# Altium schematic sheet VDMEDA_Display1.SchDoc
size A
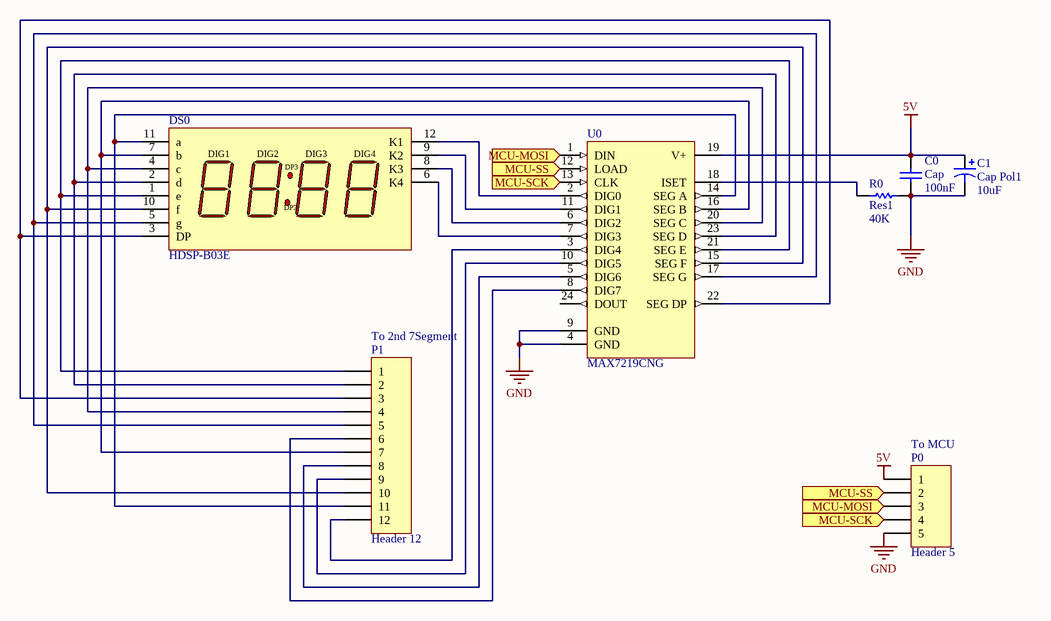
[diagram p0: VDMEDA_Display1.SchDoc]

## Parts
C0  Cap  value 100nF  [RAD-0.3]
C1  Cap Pol1  value 10uF  [RB7.6-15]
DS0  HDSP-B03E  [B-88]
P0  Header 5  [HDR1X5]
P1  Header 12  [HDR1X12]
R0  Res1  value 40K  [AXIAL-0.3]
U0  MAX7219CNG  [NG24A]

## Ports
MCU-MOSI (out), MCU-SCK (out), MCU-SS (out)

## Nets
5V: C0.2 C1.1 P0.1 U0.19(V+)
GND: C0.1 C1.2 P0.5 R0.2 U0.4(GND) U0.9(GND)
MCU-MOSI: P0.3 U0.1(DIN) ; port MCU-MOSI
MCU-SCK: P0.4 U0.13(CLK) ; port MCU-SCK
MCU-SS: P0.2 U0.12(LOAD) ; port MCU-SS
NetDS0_1: DS0.1(e) P1.1 U0.21(SEG_E)
NetDS0_2: DS0.2(d) P1.2 U0.23(SEG_D)
NetDS0_3: DS0.3(DP) P1.3 U0.22(SEG_DP)
NetDS0_4: DS0.4(c) P1.4 U0.20(SEG_C)
NetDS0_5: DS0.5(g) P1.5 U0.17(SEG_G)
NetDS0_6: DS0.6(K4) U0.7(DIG3)
NetDS0_7: DS0.7(b) P1.7 U0.16(SEG_B)
NetDS0_8: DS0.8(K3) U0.6(DIG2)
NetDS0_9: DS0.9(K2) U0.11(DIG1)
NetDS0_10: DS0.10(f) P1.10 U0.15(SEG_F)
NetDS0_11: DS0.11(a) P1.11 U0.14(SEG_A)
NetDS0_12: DS0.12(K1) U0.2(DIG0)
NetP1_6: P1.6 U0.8(DIG7)
NetP1_8: P1.8 U0.5(DIG6)
NetP1_9: P1.9 U0.10(DIG5)
NetP1_12: P1.12 U0.3(DIG4)
NetR0_1: R0.1 U0.18(ISET)

Not connected (* = marked no-connect by the designer): U0 24(DOUT)

## Notes on the sheet
- (near P1) To 2nd 7Segment
- (near P0) To MCU
- (in symbol HDSP-B03E) DIG1; DIG2; DIG3; DIG4; DP3; DP2

## Library data of the parts
C0 = Cap: Capacitor; Published: 8-Jun-2000; LatestRevisionDate: 17-Jul-2002; LatestRevisionNote: Re-released for DXP Platform.; PackageReference: RAD-0.3; Publisher: Altium Limited; PackageDescription: Radial Cap, Thru-Hole; 2 Leads; 0.3 in Pin Spacing
C1 = Cap Pol1: Polarized Capacitor (Radial); Published: 8-Jun-2000; LatestRevisionDate: 17-Jul-2002; LatestRevisionNote: Re-released for DXP Platform.; PackageReference: RB7.6-15; Publisher: Altium Limited; PackageDescription: Polarized Capacitor (Radial); 2 Leads
DS0 = HDSP-B03E: 14.22 mm GaP HER, Untinted, 88:88 4-Digit 7-Segment Display: CC, Gray Surface; LuminousIntensity: 3200 ucd (Minimum).; LED_Colour: High Efficiency Red (HER); Published: 26-May-2004; LatestRevisionDate: 11-Oct-2004; LatestRevisionNote: Display outline superimposed on PCB Footprint.; DatasheetVersion: 21-Aug-2001; PackageVersion: 21-Aug-2001; PackageReference: B-88; Publisher: Altium Limited; PackageDescription: LED, 7-Segment Display, 14.22 mm, Four Digit, 88:88; 12 Leads; Row Space 15.24 mm; Pitch 2.54 mm; ComponentLink1Description: Manufacturer Link; ComponentLink1URL: http://www.agilent.com/; ComponentLink2Description: Datasheet; ComponentLink2URL: http://cp.literature.agilent.com/litweb/pdf/5988-3569EN.pdf
P0 = Header 5: Header, 5-Pin; LatestRevisionDate: 17-Jul-2002; LatestRevisionNote: Re-released for DXP Platform.; Publisher: Altium Limited
P1 = Header 12: Header, 12-Pin; LatestRevisionDate: 17-Jul-2002; LatestRevisionNote: Re-released for DXP Platform.; Publisher: Altium Limited
R0 = Res1: Resistor; Published: 8-Jun-2000; LatestRevisionDate: 17-Jul-2002; LatestRevisionNote: Re-released for DXP Platform.; PackageReference: AXIAL-0.3; Publisher: Altium Limited; PackageDescription: Axial Device, Thru-Hole; 2 Leads; 0.3 in Pin Spacing
U0 = MAX7219CNG: Serially Interfaced, 8-Digit LED Display Driver; Published: 16-Jan-2001; LatestRevisionDate: 29-May-2009; LatestRevisionNote: Component Body Added.; DatasheetVersion: Jul-1997; PackageVersion: 1997; PackageReference: NG24A; Publisher: Altium Limited; PackageDescription: DIP, 24-Pin, Row Spacing 7.62 mm, Pitch 2.54 mm; Code_JEDEC: MS-001-AF; ComponentLink1Description: Manufacturer Link; ComponentLink1URL: http://www.maxim-ic.com/; ComponentLink2Description: Datasheet; ComponentLink2URL: http://pdfserv.maxim-ic.com/en/ds/MAX7219-MAX7221.pdf